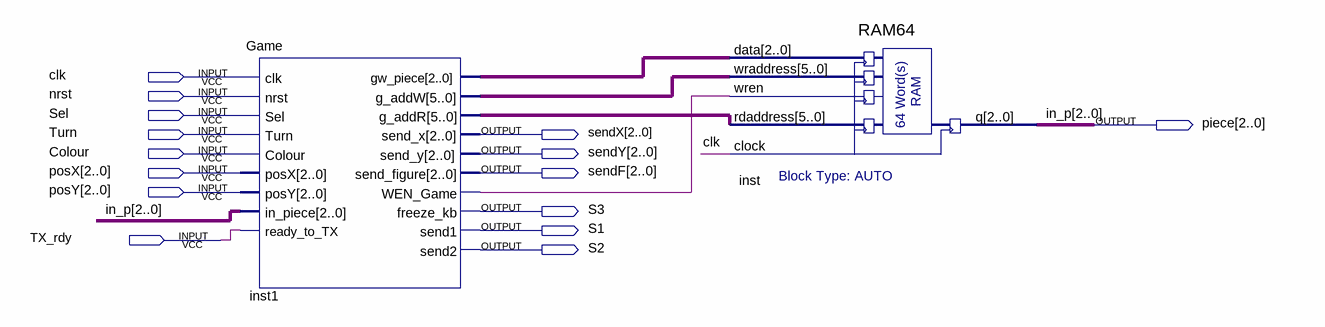
[diagram p0: schematic sheet]
// Quartus schematic VGA_blocks.bdf as structural Verilog: 2 symbols, 15 pins
module VGA_blocks (
  input  clk,
  input  nrst,
  input  Sel,
  input  Turn,
  input  Colour,
  input  [2:0] posX,
  input  [2:0] posY,
  input  TX_rdy,
  output [2:0] piece,
  output [2:0] sendX,
  output [2:0] sendY,
  output [2:0] sendF,
  output S3,
  output S1,
  output S2
);

  wire inst1_wen_game;
  wire [2:0] inst1_gw_piece;
  wire [5:0] inst1_g_addr, inst1_g_addw;

  Game inst1 (
    .clk(clk), .nrst(nrst), .Sel(Sel), .Turn(Turn), .Colour(Colour), .posX(posX), .posY(posY),
    .in_piece(piece), .ready_to_TX(TX_rdy), .gw_piece(inst1_gw_piece), .g_addW(inst1_g_addw),
    .g_addR(inst1_g_addr), .send_x(sendX), .send_y(sendY), .send_figure(sendF), .WEN_Game(inst1_wen_game),
    .freeze_kb(S3), .send1(S1), .send2(S2));
  RAM64 inst (
    .data(inst1_gw_piece), .wraddress(inst1_g_addw), .wren(inst1_wen_game), .rdaddress(inst1_g_addr),
    .clock(clk), .q(piece));

  // Other names for the same wires on the sheet: in_p[2:0] = piece
endmodule
